# Altium schematic sheet 5VRegulator.SchDoc
size 325 x 144 mm; SheetNumber: 1; SheetTotal: 1
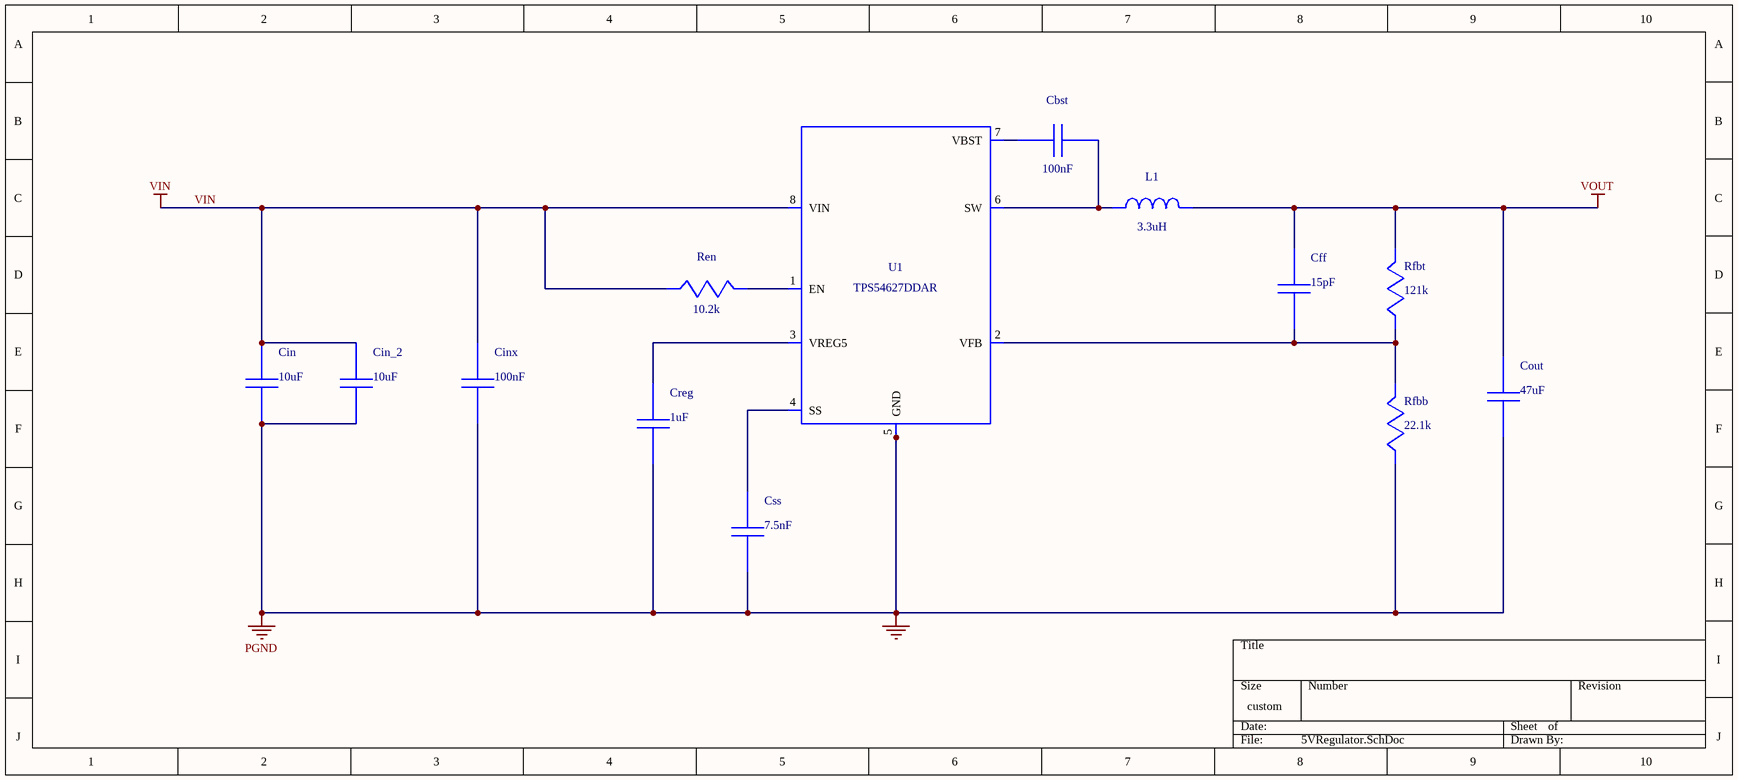
[diagram p0: 5VRegulator.SchDoc]

## Parts
Cbst  value 100nF  (hidden comment: 06033C104KAT2A)
Cff  value 15pF  (hidden comment: C0603C150M8GACTU)
Cin  value 10uF  (hidden comment: GRM31CR71E106KA12L)
Cin_2  value 10uF  (hidden comment: GRM31CR71E106KA12L)
Cinx  value 100nF  (hidden comment: 06033C104KAT2A)
Cout  value 47uF  (hidden comment: GRM31CR61A476KE15L)
Creg  value 1uF  (hidden comment: C0603C105Z8VACTU)
Css  value 7.5nF  (hidden comment: C0603C752J3GAC7867)
L1  value 3.3uH  (hidden comment: SRP1040-3R3M)
Ren  value 10.2k  (hidden comment: CRCW040210K2FKED)
Rfbb  value 22.1k  (hidden comment: CRCW040222K1FKED)
Rfbt  value 121k  (hidden comment: CRCW0402121KFKED)
U1  TPS54627DDA  (value not drawn)

## Nets
0: Cin.2 Cin_2.2 Cinx.2 Cout.2 Creg.2 Css.2 Rfbb.2 U1.5(GND) U1.9(ETPAD)  [also labelled PGND]
VIN: Cin.1 Cin_2.1 Cinx.1 Ren.2 U1.8(VIN)
VOUT: Cff.1 Cout.1 L1.2 Rfbt.1
NetCbst_1: Cbst.1 U1.7(VBST)
NetCbst_2: Cbst.2 L1.1 U1.6(SW)
NetCff_2: Cff.2 Rfbb.1 Rfbt.2 U1.2(VFB)
NetCreg_1: Creg.1 U1.3(VREG5)
NetCss_1: Css.1 U1.4(SS)
NetRen_1: Ren.1 U1.1(EN)

## Library data of the parts
Cbst Cinx = 06033C104KAT2A: Manufacturer Name: AVX; PackageReference: 06033C104KAT2A; Manufacturer Part Number: 06033C104KAT2A
Cff = C0603C150M8GACTU: Manufacturer Name: Kemet; PackageReference: C0603C150M8GACTU; Manufacturer Part Number: C0603C150M8GACTU
Cin Cin_2 = GRM31CR71E106KA12L: GRM31CR71E106KA1; Manufacturer Name: MuRata; PackageReference: GRM31CR71E106KA12L; Manufacturer Part Number: GRM31CR71E106KA12L
Cout = GRM31CR61A476KE15L: GRM31CR61A476KE1; Manufacturer Name: MuRata; PackageReference: GRM31CR61A476KE15L; Manufacturer Part Number: GRM31CR61A476KE15L
Creg = C0603C105Z8VACTU: Manufacturer Name: Kemet; PackageReference: C0603C105Z8VACTU; Manufacturer Part Number: C0603C105Z8VACTU
Css = C0603C752J3GAC7867: C0603C752J3GAC78; Manufacturer Name: Kemet; PackageReference: C0603C752J3GAC7867; Manufacturer Part Number: C0603C752J3GAC7867
L1 = SRP1040-3R3M: Manufacturer Name: Bourns; PackageReference: SRP1040-3R3M; Manufacturer Part Number: SRP1040-3R3M
Ren = CRCW040210K2FKED: Manufacturer Name: Vishay-Dale; PackageReference: CRCW040210K2FKED; Manufacturer Part Number: CRCW040210K2FKED
Rfbb = CRCW040222K1FKED: Manufacturer Name: Vishay-Dale; PackageReference: CRCW040222K1FKED; Manufacturer Part Number: CRCW040222K1FKED
Rfbt = CRCW0402121KFKED: Manufacturer Name: Vishay-Dale; PackageReference: CRCW0402121KFKED; Manufacturer Part Number: CRCW0402121KFKED
U1 = TPS54627DDA: TPS54627DDAR; Manufacturer Name: Texas Instruments; PackageReference: TPS54627DDAR; Manufacturer Part Number: TPS54627DDA; Value: Value